# Altium project Mixer.PrjPCB
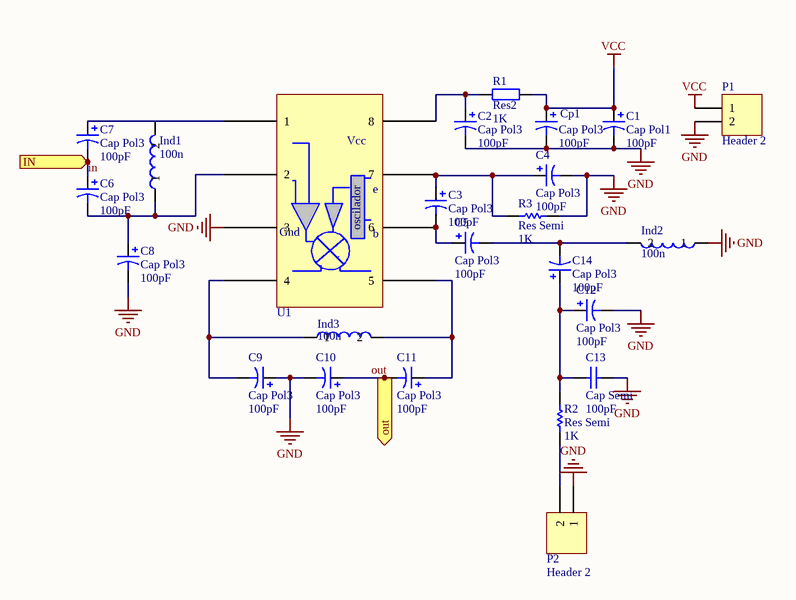
[diagram p0: Mixer.SchDoc]
1 sheet, 24 parts. Net scope: flat (ports and power ports of the same name join across sheets).
Board file: mixer.PcbDoc

## Sheet Mixer.SchDoc
size A4

### Parts
C1  Cap Pol1  value 100pF  [B]
C2  Cap Pol3  value 100pF  [C0805]
C3  Cap Pol3  value 100pF  [C0805]
C4  Cap Pol3  value 100pF  [C0805]
C5  Cap Pol3  value 100pF  [C0805]
C6  Cap Pol3  value 100pF  [C0805]
C7  Cap Pol3  value 100pF  [C0805]
C8  Cap Pol3  value 100pF  [C0805]
C9  Cap Pol3  value 100pF  [C0805]
C10  Cap Pol3  value 100pF  [C0805]
C11  Cap Pol3  value 100pF  [C0805]
C12  Cap Pol3  value 100pF  [C0805]
C13  Cap Semi  value 100pF  [C1206]
C14  Cap Pol3  value 100pF  [C0805]
Cp1  Cap Pol3  value 100pF  [C0805]
Ind1  Valor: 100n  [Ind_5mm]  (hidden comment: Ind2)
Ind2  Valor: 100n  [Ind_4mm]  (hidden comment: Ind2)
Ind3  Valor: 100n  [IND_7MM]  (hidden comment: Ind2)
P1  Header 2  [HDR1X2]
P2  Header 2  [HDR1X2]
R1  Res2  value 1K  [AXIAL-0.4]
R2  Res Semi  value 1K  [2012[0805]]
R3  Res Semi  value 1K  [2012[0805]]
U1  SA602  [SA602]  (value not drawn)

### Ports
IN (in), out (out)

### Nets
GND: C1.2 C2.2 C4.2 C8.2 C9.1 C10.2 C12.2 C13.2 Cp1.2 Ind2.1 P1.2 P2.1 R3.1 U1.3
VCC: C1.1 Cp1.1 P1.1 R1.2
in: C6.1 C7.2 ; port IN
out: C10.1 C11.2 ; port out
NetC2_1: C2.1 R1.1 U1.8
NetC3_1: C3.1 C4.1 R3.2 U1.7
NetC3_2: C3.2 C5.1 U1.6
NetC5_2: C5.2 C14.2 Ind2.2
NetC6_2: C6.2 C8.1 Ind1.1 U1.2
NetC7_1: C7.1 Ind1.2 U1.1
NetC9_2: C9.2 Ind3.1 U1.4
NetC11_1: C11.1 Ind3.2 U1.5
NetC12_1: C12.1 C13.1 C14.1 R2.2
NetP2_2: P2.2 R2.1

### Notes on the sheet
- (in symbol SA602A) Vcc; e; oscilador; Gnd; b

### Library data of the parts
C1 = Cap Pol1: Polarized Capacitor (Radial); Published: 8-Jun-2000; LatestRevisionDate: 17-Jul-2002; LatestRevisionNote: Re-released for DXP Platform.; PackageReference: RB7.6-15; Publisher: Altium Limited
C2-C12 C14 Cp1 = Cap Pol3: Polarized Capacitor (Surface Mount); Published: 8-Jun-2000; LatestRevisionDate: 17-Jul-2002; LatestRevisionNote: Re-released for DXP Platform.; PackageReference: C0805; Publisher: Altium Limited
C13 = Cap Semi: Capacitor (Semiconductor SIM Model); Published: 8-Jun-2000; LatestRevisionDate: 17-Jul-2002; LatestRevisionNote: Re-released for DXP Platform.; PackageReference: C1206; Publisher: Altium Limited
P1 P2 = Header 2: Header, 2-Pin; LatestRevisionDate: 17-Jul-2002; LatestRevisionNote: Re-released for DXP Platform.; Publisher: Altium Limited
R1 = Res2: Resistor; Published: 8-Jun-2000; LatestRevisionDate: 17-Jul-2002; LatestRevisionNote: Re-released for DXP Platform.; PackageReference: AXIAL-0.4; Publisher: Altium Limited
R2 R3 = Res Semi: Semiconductor Resistor; Published: 8-Jun-2000; LatestRevisionDate: 17-Jul-2002; LatestRevisionNote: Re-released for DXP Platform.; PackageReference: AXIAL-0.5; Publisher: Altium Limited
U1 = SA602A